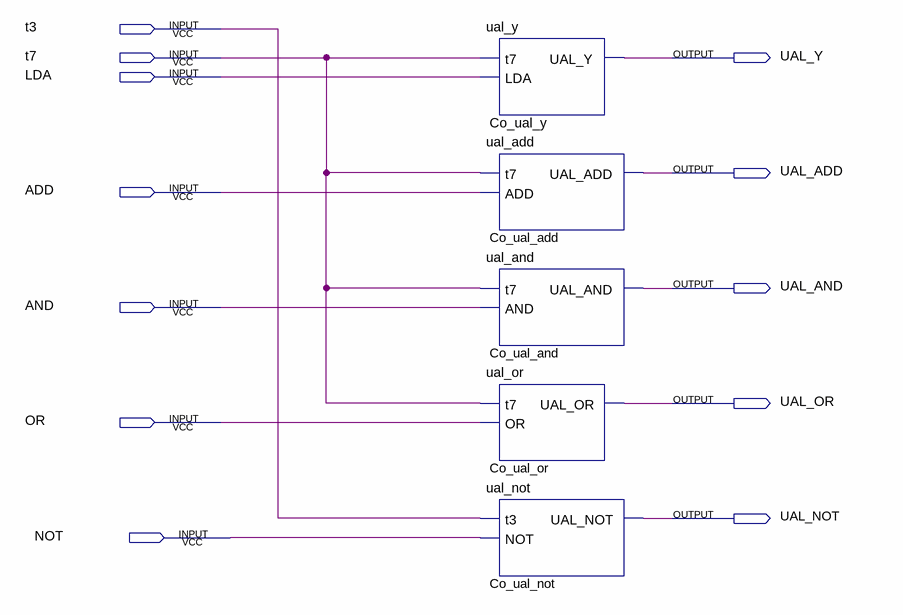
[diagram p0: schematic sheet]
// Quartus schematic ual.bdf as structural Verilog: 5 symbols, 12 pins
module ual (
  input  t3,
  input  t7,
  input  LDA,
  input  ADD,
  input  AND,
  input  OR,
  input  NOT,
  output UAL_Y,
  output UAL_ADD,
  output UAL_AND,
  output UAL_OR,
  output UAL_NOT
);

  ual_y Co_ual_y (.t7(t7), .LDA(LDA), .UAL_Y(UAL_Y));
  ual_add Co_ual_add (.t7(t7), .ADD(ADD), .UAL_ADD(UAL_ADD));
  ual_and Co_ual_and (.t7(t7), .AND(AND), .UAL_AND(UAL_AND));
  ual_or Co_ual_or (.t7(t7), .OR(OR), .UAL_OR(UAL_OR));
  ual_not Co_ual_not (.t3(t3), .NOT(NOT), .UAL_NOT(UAL_NOT));
endmodule
